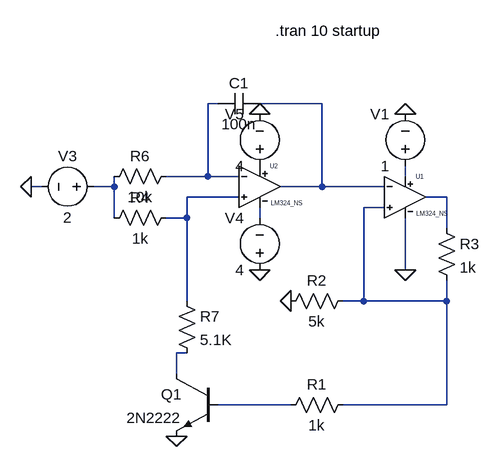
[diagram p0: schematic Draft1.asc]
Draft1.asc, the LTspice schematic file:
Version 4.1
SHEET 1 880 680
WIRE -144 -16 -160 -16
WIRE 16 -16 -80 -16
WIRE -160 96 -160 -16
WIRE -160 96 -224 96
WIRE -112 96 -160 96
WIRE 144 96 144 80
WIRE -416 112 -432 112
WIRE -304 112 -304 96
WIRE -304 112 -336 112
WIRE 16 112 16 -16
WIRE 16 112 -48 112
WIRE 112 112 16 112
WIRE -112 128 -192 128
WIRE 208 128 176 128
WIRE 112 144 80 144
WIRE -304 160 -304 112
WIRE -192 160 -192 128
WIRE -192 160 -224 160
WIRE -80 160 -80 144
WIRE 208 176 208 128
WIRE 144 240 144 160
WIRE -192 288 -192 160
WIRE 80 288 80 144
WIRE 80 288 48 288
WIRE 208 288 208 256
WIRE 208 288 80 288
WIRE -192 368 -208 368
WIRE -208 400 -208 368
WIRE -32 448 -144 448
WIRE 208 448 208 288
WIRE 208 448 48 448
FLAG -432 112 0
FLAG -80 0 0
FLAG -80 240 0
FLAG -208 496 0
FLAG 144 240 0
FLAG 144 0 0
FLAG -32 288 0
SYMBOL LM324_NS -80 48 R0
SYMATTR InstName U2
SYMBOL cap -80 -32 R90
WINDOW 0 0 32 VBottom 2
WINDOW 3 32 32 VTop 2
SYMATTR InstName C1
SYMATTR Value 100n
SYMBOL res -208 80 R90
WINDOW 0 0 56 VBottom 2
WINDOW 3 32 56 VTop 2
SYMATTR InstName R6
SYMATTR Value 10k
SYMBOL voltage -320 112 R90
WINDOW 0 -32 56 VBottom 2
WINDOW 3 32 56 VTop 2
WINDOW 123 0 0 Left 0
WINDOW 39 0 0 Left 0
SYMATTR InstName V3
SYMATTR Value 2
SYMBOL voltage -80 256 R180
WINDOW 0 24 96 Left 2
WINDOW 3 24 16 Left 2
SYMATTR InstName V4
SYMATTR Value 4
SYMBOL voltage -80 96 R180
WINDOW 0 24 96 Left 2
WINDOW 3 24 16 Left 2
SYMATTR InstName V5
SYMATTR Value 4
SYMBOL res -208 272 R0
SYMATTR InstName R7
SYMATTR Value 5.1K
SYMBOL res -208 144 R90
WINDOW 0 0 56 VBottom 2
WINDOW 3 32 56 VTop 2
SYMATTR InstName R4
SYMATTR Value 1k
SYMBOL voltage 144 96 R180
WINDOW 0 24 96 Left 2
WINDOW 3 24 16 Left 2
SYMATTR InstName V1
SYMATTR Value 1
SYMBOL LM324_NS 144 64 R0
SYMATTR InstName U1
SYMBOL res 64 432 R90
WINDOW 0 0 56 VBottom 2
WINDOW 3 32 56 VTop 2
SYMATTR InstName R1
SYMATTR Value 1k
SYMBOL npn -144 400 M0
SYMATTR InstName Q1
SYMATTR Value 2N2222
SYMBOL res 192 160 R0
SYMATTR InstName R3
SYMATTR Value 1k
SYMBOL res 64 272 R90
WINDOW 0 0 56 VBottom 2
WINDOW 3 32 56 VTop 2
SYMATTR InstName R2
SYMATTR Value 5k
TEXT -56 -128 Left 2 !.tran 10 startup

The netlist it stands for:
* Draft1.asc
X§U2 N005 N001 P001 N008 N002 LM324/NS  ; pins In+ In- V+ V- OUT
C1 N002 N001 100n
R6 N001 N004 10k
V3 N004 0 2
V4 0 N008 4
V5 P001 0 4
R7 N005 N009 5.1K
R4 N005 N004 1k
V1 N003 0 1
X§U1 N007 N002 N003 0 N006 LM324/NS  ; pins In+ In- V+ V- OUT
R1 N007 N010 1k
Q1 N009 N010 0 0 2N2222
R3 N006 N007 1k
R2 N007 0 5k
.model NPN NPN
.model PNP PNP
.lib standard.bjt
.tran 10 startup
.lib LM324.MOD
.backanno
.end